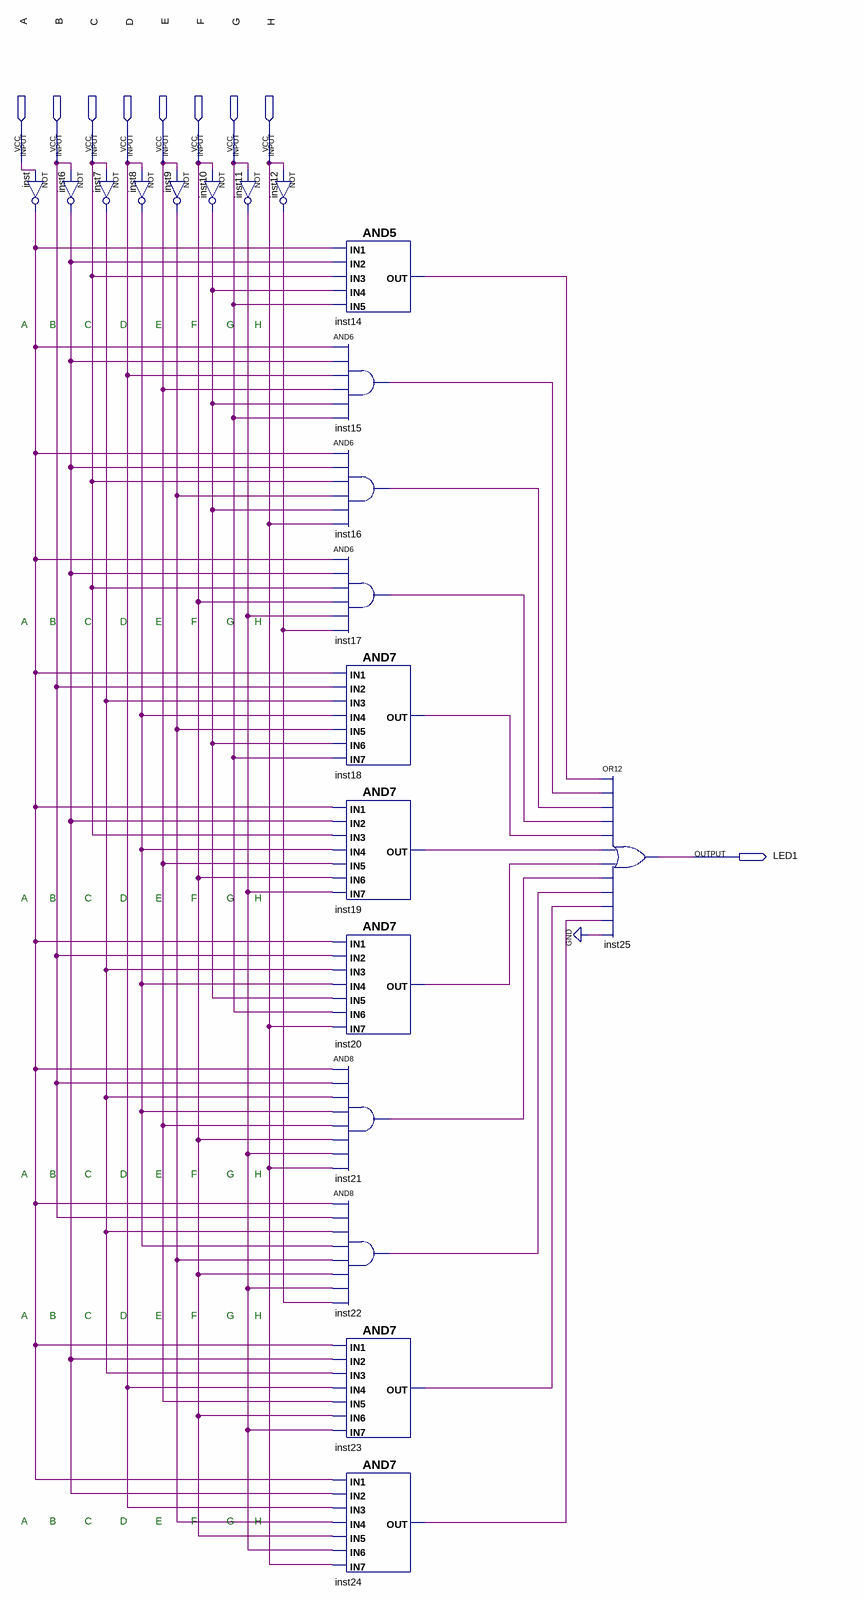
[diagram p0: schematic sheet]
// Quartus schematic LED1.bdf as structural Verilog: 20 symbols, 9 pins
module LED1 (
  input  A,
  input  B,
  input  C,
  input  D,
  input  E,
  input  F,
  input  G,
  input  H,
  output LED1
);

  wire inst6_out, inst7_out, inst8_out, inst9_out, inst10_out, inst11_out, inst12_out, inst14_out,
       inst15_out, inst16_out, inst17_out, inst18_out, inst19_out, inst20_out, inst21_out, inst22_out,
       inst23_out, inst24_out, inst_out;

  not inst (inst_out, A);
  not inst6 (inst6_out, B);
  not inst7 (inst7_out, C);
  not inst8 (inst8_out, D);
  not inst9 (inst9_out, E);
  not inst10 (inst10_out, F);
  not inst11 (inst11_out, G);
  not inst12 (inst12_out, H);
  and inst14 (inst14_out, inst_out, inst6_out, C, inst10_out, G);
  and inst15 (inst15_out, inst_out, inst6_out, D, E, inst10_out, G);
  and inst16 (inst16_out, inst_out, inst6_out, C, inst9_out, inst10_out, H);
  and inst17 (inst17_out, inst_out, inst6_out, C, F, inst11_out, inst12_out);
  and inst18 (inst18_out, inst_out, B, inst7_out, inst8_out, inst9_out, inst10_out, G);
  and inst19 (inst19_out, inst_out, inst6_out, C, inst8_out, E, F, inst11_out);
  and inst20 (inst20_out, inst_out, B, inst7_out, inst8_out, inst10_out, G, H);
  and inst21 (inst21_out, inst_out, B, inst7_out, inst8_out, E, F, inst11_out, H);
  and inst22 (inst22_out, inst_out, B, inst7_out, inst8_out, inst9_out, F, inst11_out, inst12_out);
  and inst23 (inst23_out, inst_out, inst6_out, inst7_out, D, E, F, inst11_out);
  and inst24 (inst24_out, inst_out, inst6_out, D, inst9_out, F, inst11_out, H);
  or inst25 (LED1, inst14_out, inst15_out, inst16_out, inst17_out, inst18_out, inst19_out, inst20_out, inst21_out, inst22_out, inst23_out, inst24_out, 1'b0);

  // Notes on the sheet:
  //   A
  //   B
  //   C
  //   D
  //   E
  //   F
  //   G
  //   H
  //   A
  //   B
  //   C
  //   D
  //   E
  //   F
  //   G
  //   H
  //   A
  //   B
  //   C
  //   D
  //   E
  //   F
  //   G
  //   H
  //   A
  //   B
  //   C
  //   D
  //   E
  //   F
  //   G
  //   H
  //   A
  //   B
  //   C
  //   D
  //   E
  //   F
  //   G
  //   H
  //   A
  //   B
  //   C
  //   D
  //   E
  //   F
  //   G
  //   H
endmodule
